# Altium schematic sheet Main_capacitors.SchDoc
size A4
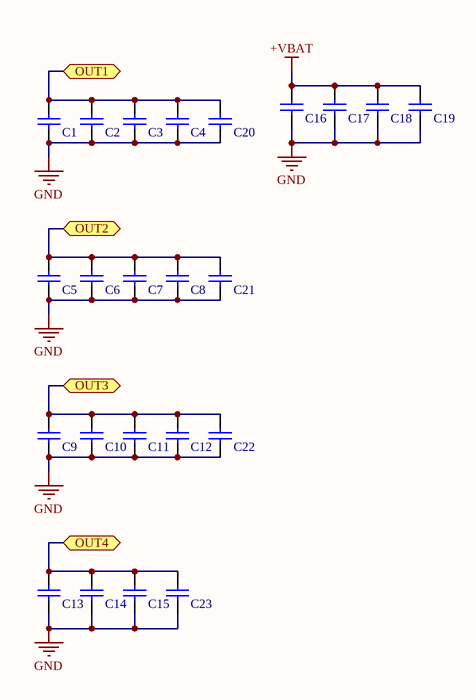
[diagram p0: Main_capacitors.SchDoc]

## Parts
C1  Capacitor NP  [2512 CAP]  (value not drawn)
C2  Capacitor NP  [2512 CAP]  (value not drawn)
C3  Capacitor NP  [2512 CAP]  (value not drawn)
C4  Capacitor NP  [2512 CAP]  (value not drawn)
C5  Capacitor NP  [2512 CAP]  (value not drawn)
C6  Capacitor NP  [2512 CAP]  (value not drawn)
C7  Capacitor NP  [2512 CAP]  (value not drawn)
C8  Capacitor NP  [2512 CAP]  (value not drawn)
C9  Capacitor NP  [2512 CAP]  (value not drawn)
C10  Capacitor NP  [2512 CAP]  (value not drawn)
C11  Capacitor NP  [2512 CAP]  (value not drawn)
C12  Capacitor NP  [2512 CAP]  (value not drawn)
C13  Capacitor NP  [2512 CAP]  (value not drawn)
C14  Capacitor NP  [2512 CAP]  (value not drawn)
C15  Capacitor NP  [2512 CAP]  (value not drawn)
C16  Capacitor NP  [2512 CAP]  (value not drawn)
C17  Capacitor NP  [2512 CAP]  (value not drawn)
C18  Capacitor NP  [2512 CAP]  (value not drawn)
C19  Capacitor NP  [2512 CAP]  (value not drawn)
C20  Capacitor NP  [0805 CAP]  (value not drawn)
C21  Capacitor NP  [0805 CAP]  (value not drawn)
C22  Capacitor NP  [0805 CAP]  (value not drawn)
C23  Capacitor NP  [0805 CAP]  (value not drawn)

## Ports
OUT1, OUT2, OUT3, OUT4

## Nets
+VBAT: C16.2 C17.2 C18.2 C19.2
GND: C1.1 C2.1 C3.1 C4.1 C5.1 C6.1 C7.1 C8.1 C9.1 C10.1 C11.1 C12.1 C13.1 C14.1 C15.1 C16.1 C17.1 C18.1 C19.1 C20.1 C21.1 C22.1 C23.1
OUT1: C1.2 C2.2 C3.2 C4.2 C20.2 ; port OUT1
OUT2: C5.2 C6.2 C7.2 C8.2 C21.2 ; port OUT2
OUT3: C9.2 C10.2 C11.2 C12.2 C22.2 ; port OUT3
OUT4: C13.2 C14.2 C15.2 C23.2 ; port OUT4

## Library data of the parts
C20-C23 = Capacitor NP: Valve: 100nF; Voltage: *
C1-C19 = Capacitor NP: Voltage: *; Valve: *